# EAGLE schematic m921-submixer (EAGLE 7.6.0)
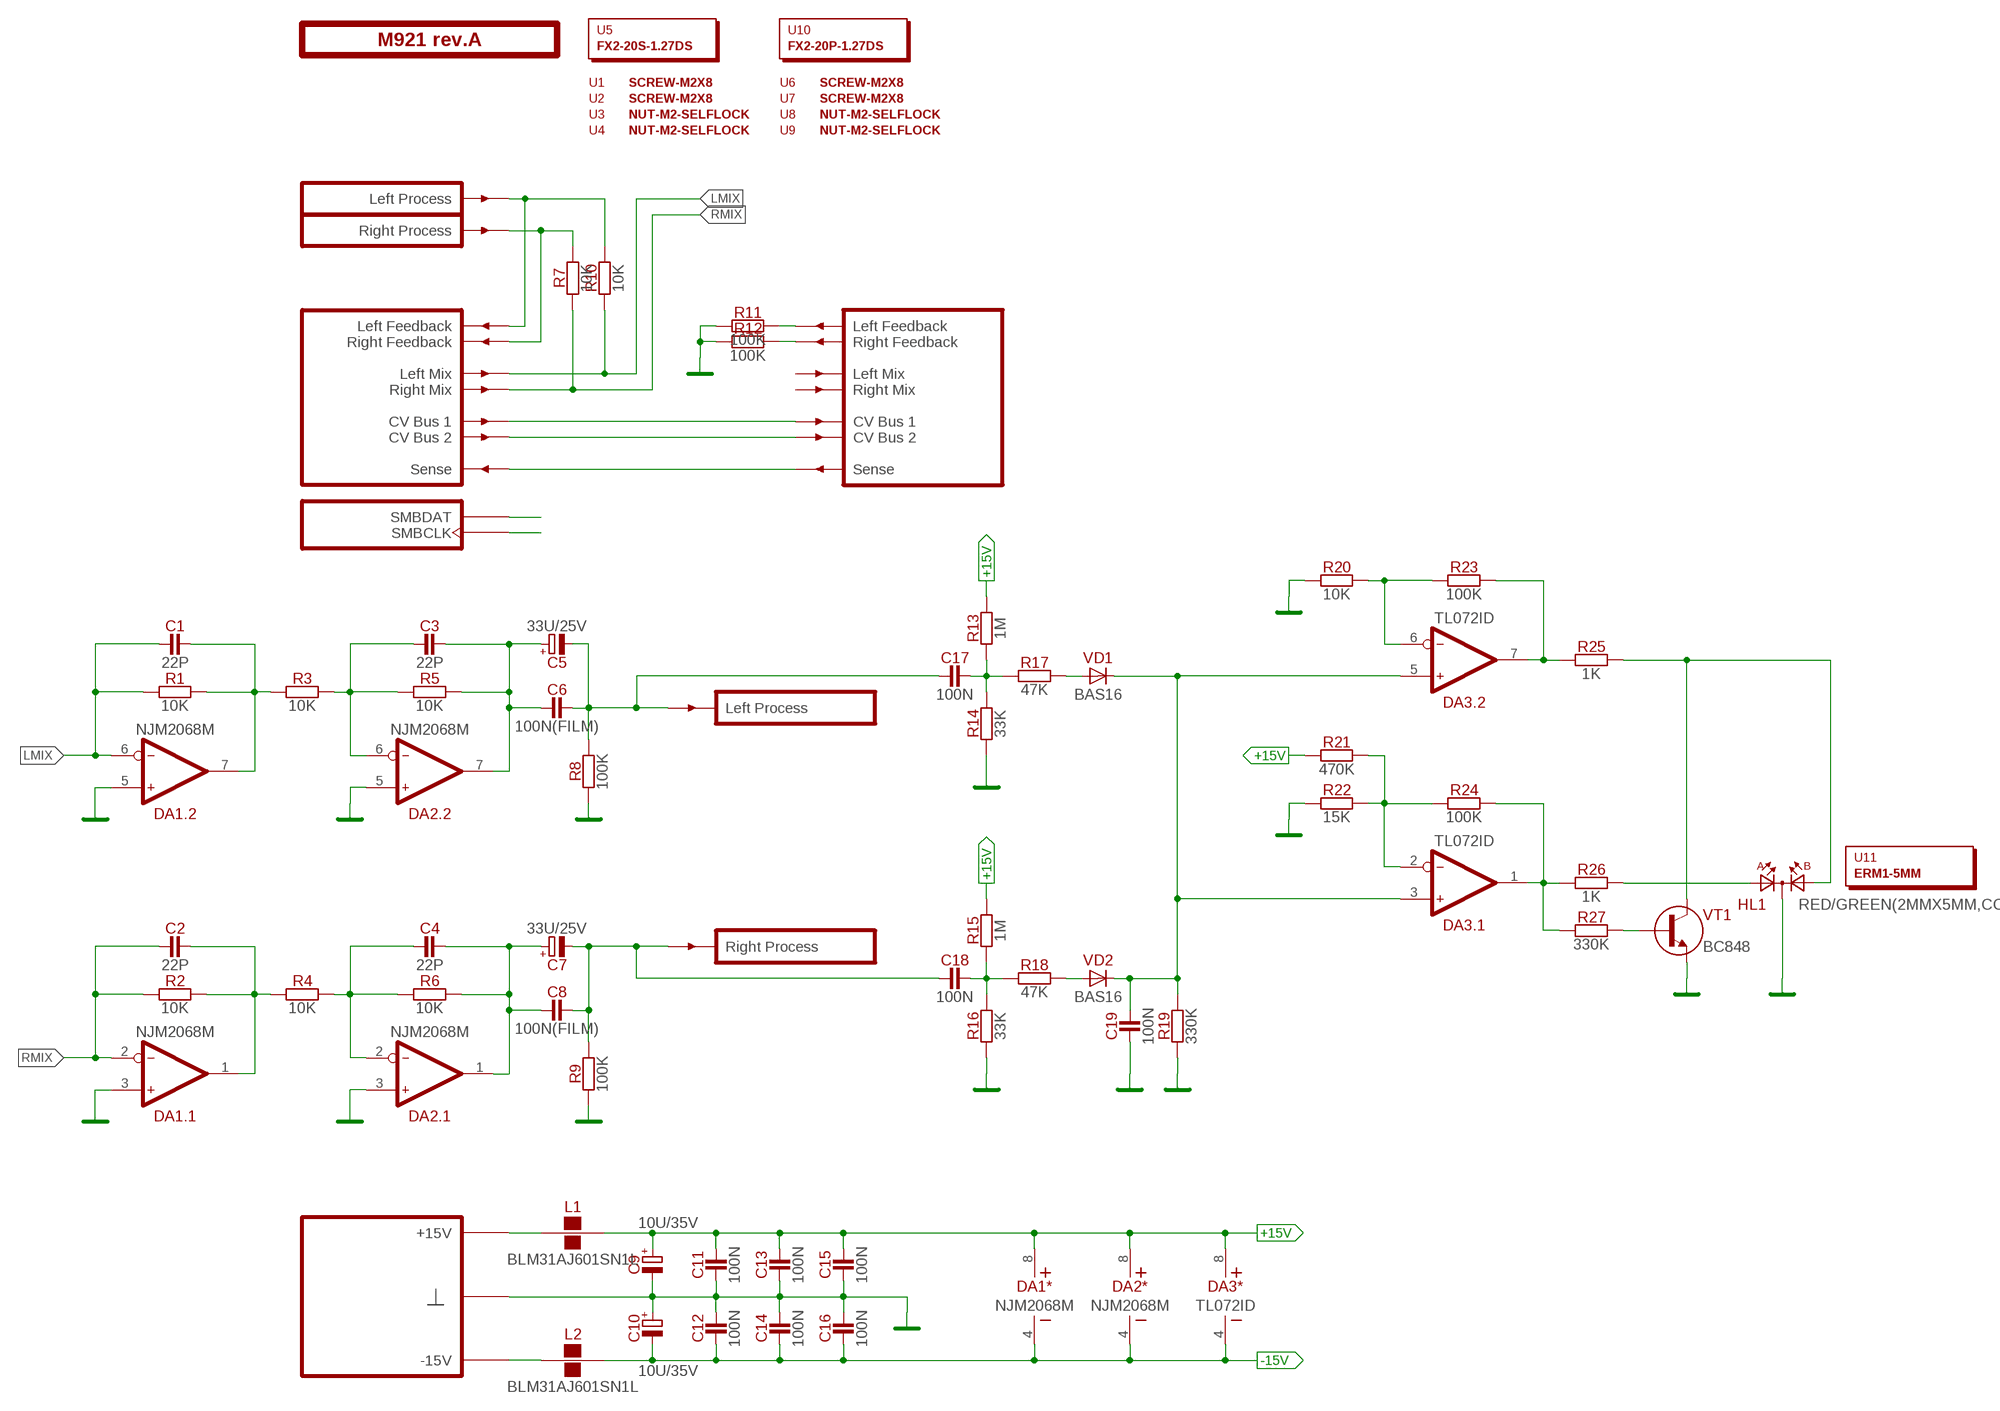
[diagram p0: schematic, sheet 1]

## Parts
C1  22P  [C-0805]
C2  22P  [C-0805]
C3  22P  [C-0805]
C4  22P  [C-0805]
C5  33U/25V  [E2,5-7]
C6  100N(FILM)  [C050-025X075]
C7  33U/25V  [E2,5-7]
C8  100N(FILM)  [C050-025X075]
C9  10U/35V  [E2-5]
C10  10U/35V  [E2-5]
C11  100N  [C-0805]
C12  100N  [C-0805]
C13  100N  [C-0805]
C14  100N  [C-0805]
C15  100N  [C-0805]
C16  100N  [C-0805]
C17  100N  [C-0805]
C18  100N  [C-0805]
C19  100N  [C-0805]
DA1  NJM2068M  [SO-8]
DA2  NJM2068M  [SO-8]
DA3  TL072ID  [SO-8]
HL1  RED/GREEN(2MMX5MM,CC)  [LED2X5-3PIN]
L1  BLM31AJ601SN1L  [1206]
L2  BLM31AJ601SN1L  [1206]
PCB1  M921 rev.A  ST2-BOARD-26  [ST2-BOARD-26]
R1  10K  [R-0805]
R2  10K  [R-0805]
R3  10K  [R-0805]
R4  10K  [R-0805]
R5  10K  [R-0805]
R6  10K  [R-0805]
R7  10K  [R-0805]
R8  100K  [R-0805]
R9  100K  [R-0805]
R10  10K  [R-0805]
R11  100K  [R-0805]
R12  100K  [R-0805]
R13  1M  [R-0805]
R14  33K  [R-0805]
R15  1M  [R-0805]
R16  33K  [R-0805]
R17  47K  [R-0805]
R18  47K  [R-0805]
R19  330K  [R-0805]
R20  10K  [R-0805]
R21  470K  [R-0805]
R22  15K  [R-0805]
R23  100K  [R-0805]
R24  100K  [R-0805]
R25  1K  [R-0805]
R26  1K  [R-0805]
R27  330K  [R-0805]
U1  SCREW-M2X8  [EMPTY]
U2  SCREW-M2X8  [EMPTY]
U3  NUT-M2-SELFLOCK  [EMPTY]
U4  NUT-M2-SELFLOCK  [EMPTY]
U5  FX2-20S-1.27DS  [EMPTY]
U6  SCREW-M2X8  [EMPTY]
U7  SCREW-M2X8  [EMPTY]
U8  NUT-M2-SELFLOCK  [EMPTY]
U9  NUT-M2-SELFLOCK  [EMPTY]
U10  FX2-20P-1.27DS  [EMPTY]
U11  ERM1-5MM  [EMPTY]
VD1  BAS16  [SOT23]
VD2  BAS16  [SOT23]
VT1  BC848  [SOT23]

## Nets
+15V [power]: C9.+ C11.2 C13.2 C15.2 DA1.8(*:V+) DA2.8(*:V+) DA3.8(*:V+) L1.2 R13.2 R15.2 R21.1
-15V: C10.- C12.1 C14.1 C16.1 DA1.4(*:V-) DA2.4(*:V-) DA3.4(*:V-) L2.2
GND: C9.- C10.+ C11.1 C12.2 C13.1 C14.2 C15.1 C16.2 C19.1 DA1.3(.1:IN+) DA1.5(.2:IN+) DA2.3(.1:IN+) DA2.5(.2:IN+) HL1.K PCB1.B4'(GND) PCB1.B4(GND) PCB1.B5'(GND) PCB1.B5(GND) PCB1.B6'(GND) PCB1.B6(GND) PCB1.B7'(GND) PCB1.B7(GND) PCB1.B8'(GND) PCB1.B8(GND) R8.1 R9.1 R11.1 R12.1 R14.1 R16.1 R19.1 R20.1 R22.1 VT1.2(E)
LMIX: C1.1 DA1.6(.2:IN-) PCB1.ALMIX(LMIX) R1.1 R10.1
N$1: L1.1 PCB1.A+15'(P+15V) PCB1.A+15(P+15V) PCB1.B+15'(P+15V) PCB1.B+15(P+15V)
N$2: PCB1.BSENSE'(SENSE') PCB1.BSENSE(SENSE)
N$4: PCB1.ACV2'(CV2') PCB1.ACV2(CV2)
N$5: L2.1 PCB1.A-15'(P-15V) PCB1.A-15(P-15V) PCB1.B-15'(P-15V) PCB1.B-15(P-15V)
N$6: PCB1.ACV1'(CV1') PCB1.ACV1(CV1)
N$7: C1.2 DA1.7(.2:OUT) R1.2 R3.1
N$8: C2.2 DA1.1(.1:OUT) R2.2 R4.1
N$13: DA3.6(.2:IN-) R20.2 R23.1
N$17: DA3.7(.2:OUT) R23.2 R25.1
N$18: C7.- C8.2 C18.1 PCB1.BOUTR'(OUTR) R9.2
N$19: C5.- C6.2 C17.1 PCB1.BOUTL'(OUTL) R8.2
N$20: C17.2 R13.1 R14.2 R17.1
N$21: R17.2 VD1.1(A)
N$22: C18.2 R15.1 R16.2 R18.1
N$23: R18.2 VD2.1(A)
N$24: C19.2 DA3.3(.1:IN+) DA3.5(.2:IN+) R19.2 VD1.2(C) VD2.2(C)
N$26: PCB1.ALFBK'(LFBK') R11.2
N$27: PCB1.ARFBK'(RFBK') R12.2
N$29: HL1.A2 R25.2 VT1.3(C)
N$30: DA3.2(.1:IN-) R21.2 R22.2 R24.1
N$31: DA3.1(.1:OUT) R24.2 R26.1 R27.1
N$32: R27.2 VT1.1(B)
N$33: HL1.A1 R26.2
N$38: PCB1.ASMBDAT'(SMBDAT) PCB1.ASMBDAT(SMBDAT)
N$39: PCB1.ARFBK(RFBK) PCB1.BINR(INR) R7.2
N$40: PCB1.ALFBK(LFBK) PCB1.BINL(INL) R10.2
N$43: PCB1.ASMBCLK'(SMBCLK) PCB1.ASMBCLK(SMBCLK)
N$54: C3.1 DA2.6(.2:IN-) R3.2 R5.1
N$55: C3.2 C5.+ C6.1 DA2.7(.2:OUT) R5.2
N$56: C4.1 DA2.2(.1:IN-) R4.2 R6.1
N$57: C4.2 C7.+ C8.1 DA2.1(.1:OUT) R6.2
RMIX: C2.1 DA1.2(.1:IN-) PCB1.ARMIX(RMIX) R2.1 R7.1
Unconnected: PCB1.ALMIX'(LMIX') PCB1.ARMIX'(RMIX')

## Library data of the parts
C1-C4 = capacitors:?; MOUSER: 77-VJ0805A220GXACBC
C5 C7 = capacitors-electrolytic:?
C6 C8 = capacitors:?; MOUSER: 505-MKS2.1/63/5
C9 C10 = capacitors-electrolytic:?; MOUSER: 647-USW1V100MDD
C11-C19 = capacitors:?; MOUSER: 77-VJ0805V104MXBPBC
DA1 DA2 = ic-jrc:NJM2068; MOUSER: 513-NJM2068M
DA3 = ic-ti:TL072; MOUSER: 511-TL072IDT
HL1 = optoelectronics:?(2MMX5MM,CC)
L1 L2 = inductors:BLM31AJ601SN1L; MOUSER: 81-BLM31AJ601SN1L
PCB1 = module-footprints:ST2-BOARD-?
R1-R7 R10 R20 = resistors:?; MOUSER: 660-RK73H2ATTD1002F
R8 R9 R11 R12 R23 R24 = resistors:?; MOUSER: 660-RK73H2ATTD1003F
R13 R15 = resistors:?; MOUSER: 660-RK73H2ATTD1004F
R14 R16 = resistors:?; MOUSER: 660-RK73H2ATTD3302F
R17 R18 = resistors:?; MOUSER: 660-RK73H2ATTD4702F
R19 R27 = resistors:?; MOUSER: 660-RK73H2ATTD3303F
R21 = resistors:?; MOUSER: 660-RK73H2ATTD4703F
R22 = resistors:?; MOUSER: 660-RK73H2ATTD1502F
R25 R26 = resistors:?; MOUSER: 660-RK73H2ATTD1001F
U1-U4 U6-U9 = hardware:*?
U5 = hardware:?; MOUSER: 798-FX2-20S-1.27DS71
U10 = hardware:?; MOUSER: 798-FX2-20P-1.27DS71
U11 = hardware:?
VD1 VD2 = diodes:?; MOUSER: 863-BAS16LT3G
VT1 = transistors-npn:?; MOUSER: 863-BC848BLT3G